# EAGLE design Tariq (EAGLE 9.0.1)
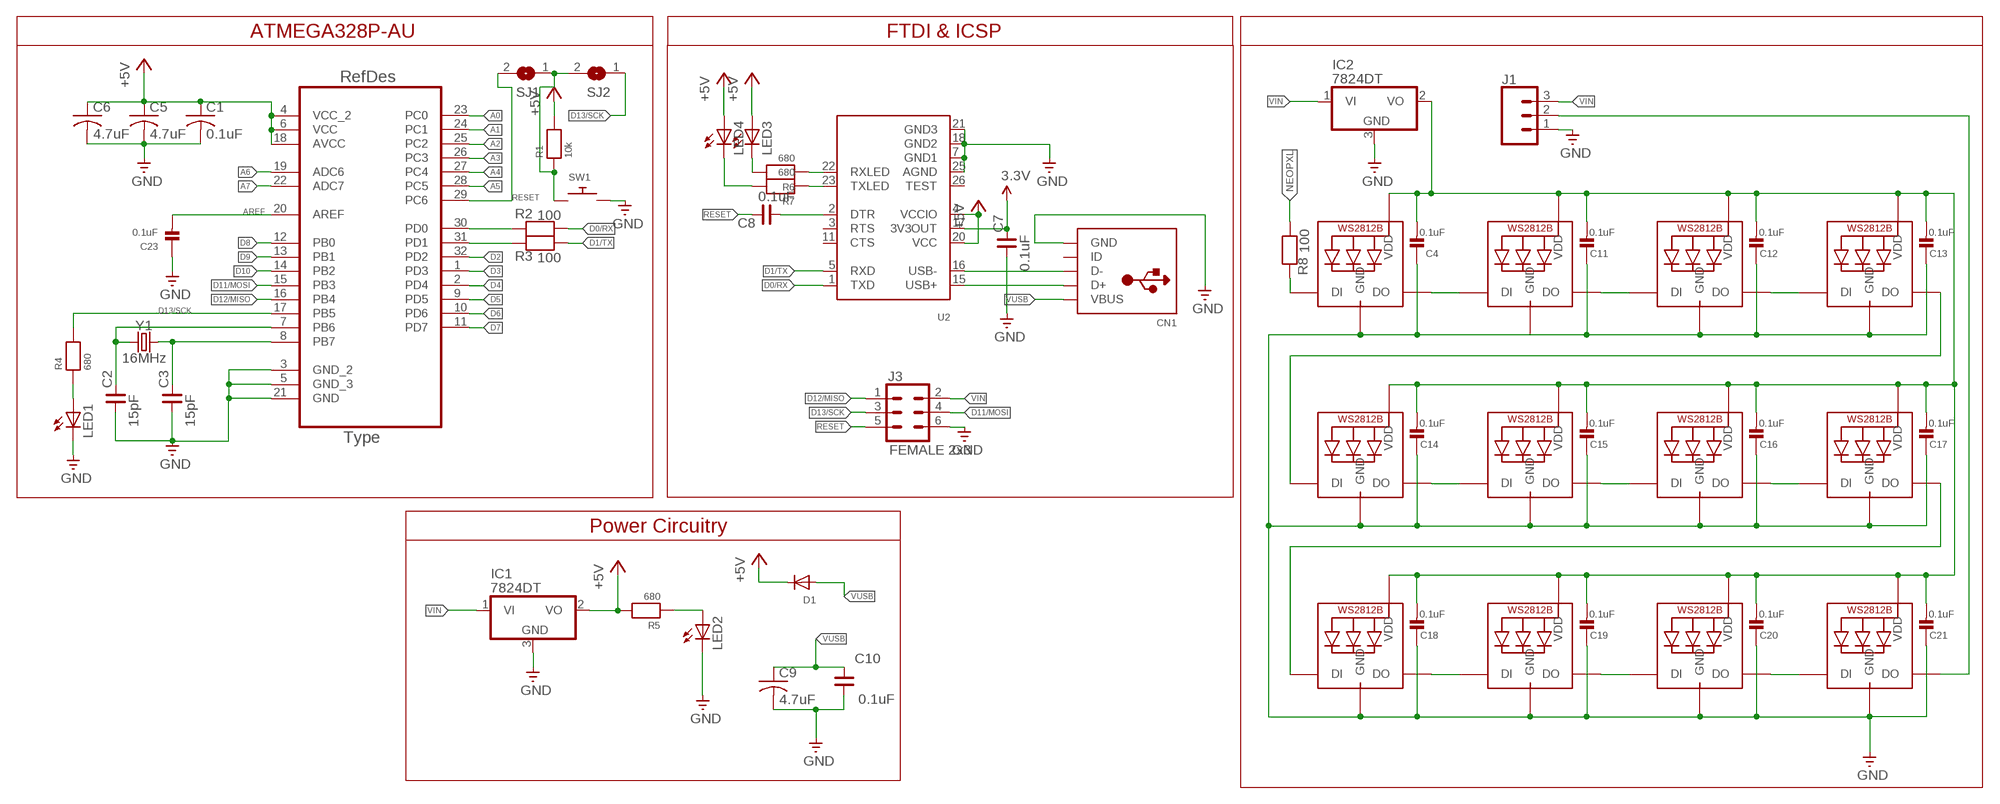
[diagram p0: schematic, sheet 1]

## Parts
C1  0.1uF  C-USC0805  [C0805]
C2  15pF  CNP-0805  [0805]
C3  15pF  CNP-0805  [0805]
C4  0.1uF  CAP_CERAMIC0603  [0603]
C5  4.7uF  C-USC0805  [C0805]
C6  4.7uF  C-USC0805  [C0805]
C7  0.1uF  CNP-0805  [0805]
C8  0.1uF  CNP-0805  [0805]
C9  4.7uF  C-USC0805  [C0805]
C10  0.1uF  CNP-0805  [0805]
C11  0.1uF  CAP_CERAMIC0603  [0603]
C12  0.1uF  CAP_CERAMIC0603  [0603]
C13  0.1uF  CAP_CERAMIC0603  [0603]
C14  0.1uF  CAP_CERAMIC0603  [0603]
C15  0.1uF  CAP_CERAMIC0603  [0603]
C16  0.1uF  CAP_CERAMIC0603  [0603]
C17  0.1uF  CAP_CERAMIC0603  [0603]
C18  0.1uF  CAP_CERAMIC0603  [0603]
C19  0.1uF  CAP_CERAMIC0603  [0603]
C20  0.1uF  CAP_CERAMIC0603  [0603]
C21  0.1uF  CAP_CERAMIC0603  [0603]
C23  0.1uF  CAP_CERAMIC0603  [0603]
CN1  USBMINIB  [USB-MINIB]
D1  DIODESOD-123  [SOD-123]
IC1  7824DT  [TO252]
IC2  7824DT  [TO252]
J1  CONN_03  [1X03]
J3  FEMALE 2x3  CONN_03X2FEMALE  [2X3]
LED1  LEDCHIPLED_0805  [CHIPLED_0805]
LED2  LEDCHIPLED_0805  [CHIPLED_0805]
LED3  LEDCHIPLED_0805  [CHIPLED_0805]
LED4  LEDCHIPLED_0805  [CHIPLED_0805]
LED5  WS2812B5050  [WS2812B]
LED6  WS2812B5050  [WS2812B]
LED7  WS2812B5050  [WS2812B]
LED8  WS2812B5050  [WS2812B]
LED9  WS2812B5050  [WS2812B]
LED10  WS2812B5050  [WS2812B]
LED11  WS2812B5050  [WS2812B]
LED12  WS2812B5050  [WS2812B]
LED13  WS2812B5050  [WS2812B]
LED14  WS2812B5050  [WS2812B]
LED15  WS2812B5050  [WS2812B]
LED16  WS2812B5050  [WS2812B]
R1  10k  RESISTOR0603  [0603]
R2  100  RESISTOR0603  [0603]
R3  100  RESISTOR0603  [0603]
R4  680  RESISTOR0603  [0603]
R5  680  RESISTOR0603  [0603]
R6  680  RESISTOR0603  [0603]
R7  680  RESISTOR0603  [0603]
R8  100  RESISTOR0603  [0603]
SJ1  SOLDERJUMPERWAVE  [SOLDERJUMPER_WAVE]
SJ2  SOLDERJUMPERWAVE  [SOLDERJUMPER_WAVE]
SW1  SWITCH_PUSHBUTTONEVQ-PE  [TACT_PANA-EVQ]
U1  ATMEGA328P-AU  [QFP80P900X900X120-32N]
U2  FT232RLSSOP28  [SSOP28DB]
Y1  16MHz  CRYSTAL-16MHZPTH-HC49US  [HC49US]

## Nets
3.3V: C7.2 U2.17(3V3OUT)
+5V: C1.1 C5.1 C6.1 D1.C IC1.2(VO) LED3.A LED4.A R1.2 R5.2 U1.4(VCC_2) U1.6(VCC) U1.18(AVCC) U2.4(VCCIO) U2.20(VCC)
A0: U1.23(PC0)
A1: U1.24(PC1)
A2: U1.25(PC2)
A3: U1.26(PC3)
A4: U1.27(PC4)
A5: U1.28(PC5)
A6: U1.19(ADC6)
A7: U1.22(ADC7)
AREF: C23.2 U1.20(AREF)
D0/RX: R2.1 U2.1(TXD)
D1/TX: R3.1 U2.5(RXD)
D2: U1.32(PD2)
D3: U1.1(PD3)
D4: U1.2(PD4)
D5: U1.9(PD5)
D6: U1.10(PD6)
D7: U1.11(PD7)
D8: U1.12(PB0)
D9: U1.13(PB1)
D10: U1.14(PB2)
D11/MOSI: J3.4 U1.15(PB3)
D12/MISO: J3.1 U1.16(PB4)
D13/SCK: J3.3 R4.2 SJ2.1 U1.17(PB5)
GND: C1.2 C2.1 C3.1 C4.1 C5.2 C6.2 C7.1 C9.2 C10.1 C11.1 C12.1 C13.1 C14.1 C15.1 C16.1 C17.1 C18.1 C19.1 C20.1 C21.1 C23.1 CN1.GND IC1.3(GND) IC2.3(GND) J1.1 J3.6 LED1.C LED2.C LED5.3-GND(GND) LED6.3-GND(GND) LED7.3-GND(GND) LED8.3-GND(GND) LED9.3-GND(GND) LED10.3-GND(GND) LED11.3-GND(GND) LED12.3-GND(GND) LED13.3-GND(GND) LED14.3-GND(GND) LED15.3-GND(GND) LED16.3-GND(GND) SW1.P$2 U1.3(GND_2) U1.5(GND_3) U1.21(GND) U2.7(GND1) U2.18(GND2) U2.21(GND3) U2.25(AGND)
N$1: C3.2 U1.8(PB7) Y1.2
N$2: C2.2 U1.7(PB6) Y1.1
N$4: LED2.A R5.1
N$5: CN1.D+ U2.15(USB+)
N$6: CN1.D- U2.16(USB-)
N$7: R2.2 U1.30(PD0)
N$8: R3.2 U1.31(PD1)
N$9: LED3.C R6.2
N$10: LED1.A R4.1
N$11: LED5.2-DOUT(DO) LED6.4-DIN(DI)
N$12: R6.1 U2.22(RXLED)
N$13: R7.1 U2.23(TXLED)
N$14: C8.1 U2.2(DTR)
N$15: LED4.C R7.2
N$16: LED6.2-DOUT(DO) LED7.4-DIN(DI)
N$17: LED7.2-DOUT(DO) LED8.4-DIN(DI)
N$18: LED8.2-DOUT(DO) LED9.4-DIN(DI)
N$19: C4.2 C11.2 C12.2 C13.2 C14.2 C15.2 C16.2 C17.2 C18.2 C19.2 C20.2 C21.2 IC2.2(VO) LED5.1-VDD(VDD) LED6.1-VDD(VDD) LED7.1-VDD(VDD) LED8.1-VDD(VDD) LED9.1-VDD(VDD) LED10.1-VDD(VDD) LED11.1-VDD(VDD) LED12.1-VDD(VDD) LED13.1-VDD(VDD) LED14.1-VDD(VDD) LED15.1-VDD(VDD) LED16.1-VDD(VDD)
N$20: LED9.2-DOUT(DO) LED10.4-DIN(DI)
N$21: LED10.2-DOUT(DO) LED11.4-DIN(DI)
N$22: LED11.2-DOUT(DO) LED12.4-DIN(DI)
N$23: LED12.2-DOUT(DO) LED13.4-DIN(DI)
N$24: LED13.2-DOUT(DO) LED14.4-DIN(DI)
N$25: LED14.2-DOUT(DO) LED15.4-DIN(DI)
N$26: LED15.2-DOUT(DO) LED16.4-DIN(DI)
N$27: LED5.4-DIN(DI) R8.2
N$29: J1.2 LED16.2-DOUT(DO)
N$30: R1.1 SJ1.1 SJ2.2 SW1.P$1
NEOPXL: R8.1
RESET: C8.2 J3.5 SJ1.2 U1.29(PC6)
VIN: IC1.1(VI) IC2.1(VI) J1.3 J3.2
VUSB: C9.1 C10.2 CN1.VBUS D1.A
Unconnected: CN1.ID U2.3(RTS) U2.11(CTS) U2.26(TEST)

## Notes on the sheet
- ATMEGA328P-AU | FTDI & ICSP
- Power Circuitry

## Library data of the parts
C1 C5 C6 C9 = adafruit:C-US: CAPACITOR, American symbol
C2 C3 C7 C8 C10 = cap-master:CNP-: NON-POLARIZED CAP
C4 C11-C21 C23 = microbuilder:CAP_CERAMIC: Ceramic Capacitors 0402 - 0402 Surface Mount Capacitors 16pF 50V 5% [Digikey: 445-4899-2-ND] 18pF 50V 5% [Digikey: 490-1281-2-ND] 22pF 50V 5% [Digikey: 490-1283-2-ND] 68pF 50V 5% [Digikey: 490-1289-2-ND] 0.1uF 10V 10% [Digikey: 490-1318-2-ND] 1.0uF 6.3V 10% [Digikey: 490-1320-2-ND] 0603 - 0603 Surface Mount Capacitors 16 pF 50V 5% [Digikey: 445-5051-2-ND] 22 pF 50V [Digikey: PCC220ACVTR-ND] 33 pF 50V 5% [Digikey: 490-1415-1-ND] 56pF 50V 5% [Digikey: 490-1421-1-ND] 220pF 50V 5% [Digikey: 445-1285-1-ND] 680 pF 50V 2200 pF 50V 5% C0G [Digikey: 445-1297-1-ND] 5600 pF 100V 5% X7R [Digikey: 478-3711-1-ND] 0.1 µF 25V 10% [Digikey: PCC2277TR-ND] 0.22 µF 16V 10% X7R [Digikey: 445-1318-1-ND] 1.0 µF 25V 10% [Digikey: 445-5146-2-ND] 0603 - RF Specific 3pF 250V +/-0.1pF RF [Digikey: 712-1347-1-ND] 18 pF 250V 5% [Digikey: 478-3505-1-ND or 712-1322-1-ND] 56 pF 250V 5% C0G RF [Digikey: 490-4867-1-ND] 68 pF 250V RF [Digikey: 490-4868-1-ND] 0805 - 0805 Surface Mount Capacitors 220 pF 250V 2% RF Ceramic Capacitor [Digikey: 712-1398-1-ND] 1000 pF 50V 2% NP0 Ceramic Capacitor [Digikey: 478-3760-1-ND] 0.1 µF 25V 10% Ceramic Capacitor [Digikey: PCC1828TR-ND] 1.0 µF 16V 10% Ceramic Capacitor[Digikey: 490-1691-2-ND] 10.0 µF 10V 10% Ceramic Capacitor[Digikey: 709-1228-1-ND] 10.0 uF 16V 10% Ceramic Capacitor [Digikey: 478-5165-2-ND] 47 uF 6.3V 20% Ceramic Capacitor [Digikey: 587-1779-1-ND or 399-5506-1-ND] 1206 - 1206 Surface Mount Capacitors 47uF 10V 20% Ceramic Capacitor [Digikey: 490-5528-1-ND or 399-5508-1-ND or 445-6010-1-ND]
CN1 = adafruit:USB: USB Connectors USBMINIB - Surface Mount Female Mini-B USB Connector 4UConnector: 06564 By microbuilder.eu Thru-hole RA Female Mini-B USB Connector 4UConnector: 18732 By ladyada.net
D1 = adafruit:DIODE: Diode SMADIODE - SMA Surface Mount Package 20V 1A Schottky Diode Digikey: 641-1014-6-ND DO-1N4148 - Through Hole Small Current Diode SOD-123 20V 1 A (.5mV Vf) Schottky Diode - Digikey: MBRX120TPMSCT-ND SOD-323 10V 570mA (.38mV Vf, 3ns) Schottky Diode - Digikey: ZLLS410CT-ND SOD-523 30V 30mA Schottky Diode (RB751S-40TE61) - Digikey: RB751S-40TE61CT-ND SOT23-R/W - SOT23 Package (R = Solder Paste/Reflow Ovens, W = Hand-Soldering) BAT54Film 40V 300mA - Digikey: 497-7162-1-ND
IC1 IC2 = adafruit:78*: Positive VOLTAGE REGULATOR Added bigger pads to the TO-92 package
J1 = SparkFun-Connectors:CONN_03: Multi connection point. Often used as Generic Header-pin footprint for 0.1 inch spaced/style header connections On any of the 0.1 inch spaced packages, you can populate with these: Break Away Headers - Straight <https://www.sparkfun.com/products/116> (PRT-00116) Break Away Male Headers - Right Angle <https://www.sparkfun.com/products/553> (PRT-00553) Female Headers <https://www.sparkfun.com/products/115> (PRT-00115) Break Away Headers - Machine Pin <https://www.sparkfun.com/products/117> (PRT-00117) Break Away Female Headers - Swiss Machine Pin <https://www.sparkfun.com/products/743> (PRT-00743) Stackable Header - 3 Pin (Female, 0.1") <https://www.sparkfun.com/products/13875> (PRT-13875) For SCREWTERMINALS and SPRING TERMINALS visit here: Screw Terimnals on SparkFun.com <https://www.sparkfun.com/search/results?term=Screw+Terminals> (5mm/3.5mm/2.54mm spacing) This device is also useful as a general connection point to wire up your design to another part of your project. Our various solder wires solder well into these plated through hole pads. Hook-Up Wire - Assortment (Stranded, 22 AWG) <https://www.sparkfun.com/products/11375> (PRT-11375) Hook-Up Wire - Assortment (Solid Core, 22 AWG) <https://www.sparkfun.com/products/11367> (PRT-11367) View the entire wire category on our website here <https://www.sparkfun.com/categories/141> Special notes: Molex polarized connector foot print use with SKU : PRT-08232 with associated crimp pins and housings.
J3 = SparkFun-Connectors:CONN_03X2: Multi connection point. Often used as Generic Header-pin footprint for 0.1 inch spaced/style header connections You can populate with any combo of single row headers, but if you'd like an exact match, check these: Header - 2x3 (Male, 0.1") <https://www.sparkfun.com/products/12807> (PRT-12807) Header - 2x3 (Female, 0.1") <https://www.sparkfun.com/products/13010> (PRT-13010) 2x3 Pin Shrouded Header <https://www.sparkfun.com/products/10877> (PRT-10877) On any of the 0.1 inch spaced packages, you can populate with these: Break Away Headers - Straight <https://www.sparkfun.com/products/116> (PRT-00116) Break Away Male Headers - Right Angle <https://www.sparkfun.com/products/553> (PRT-00553) Female Headers <https://www.sparkfun.com/products/115> (PRT-00115) Break Away Headers - Machine Pin <https://www.sparkfun.com/products/117> (PRT-00117) Break Away Female Headers - Swiss Machine Pin <https://www.sparkfun.com/products/743> (PRT-00743) Special note: the shrouded connector mates well with our 3x2 ribbon cables: Ribbon Crimp Connector - 6-pin (2x3, Female) <https://www.sparkfun.com/products/10651> (PRT-10651) Ribbon Cable - 6 wire (15ft) <https://www.sparkfun.com/products/10646> (PRT-10646); PROD_ID: CONN-11566
LED1-LED4 = adafruit:LED: LED OSRAM: - CHIPLED LG R971, LG N971, LY N971, LG Q971, LY Q971, LO R971, LY R971 LH N974, LH R974 LS Q976, LO Q976, LY Q976 LO Q996 - Hyper CHIPLED LW Q18S LB Q993, LB Q99A, LB R99A - SideLED LS A670, LO A670, LY A670, LG A670, LP A670 LB A673, LV A673, LT A673, LW A673 LH A674 LY A675 LS A676, LA A676, LO A676, LY A676, LW A676 LS A679, LY A679, LG A679 - Hyper Micro SIDELED® LS Y876, LA Y876, LO Y876, LY Y876 LT Y87S - SmartLED LW L88C, LW L88S LB L89C, LB L89S, LG L890 LS L89K, LO L89K, LY L89K LS L896, LA L896, LO L896, LY L896 - TOPLED LS T670, LO T670, LY T670, LG T670, LP T670 LSG T670, LSP T670, LSY T670, LOP T670, LYG T670 LG T671, LOG T671, LSG T671 LB T673, LV T673, LT T673, LW T673 LH T674 LS T676, LA T676, LO T676, LY T676, LB T676, LH T676, LSB T676, LW T676 LB T67C, LV T67C, LT T67C, LS T67K, LO T67K, LY T67K, LW E67C LS E67B, LA E67B, LO E67B, LY E67B, LB E67C, LV E67C, LT E67C LW T67C LS T679, LY T679, LG T679 LS T770, LO T770, LY T770, LG T770, LP T770 LB T773, LV T773, LT T773, LW T773 LH T774 LS E675, LA E675, LY E675, LS T675 LS T776, LA T776, LO T776, LY T776, LB T776 LHGB T686 LT T68C, LB T68C - Hyper Mini TOPLED® LB M676 - Mini TOPLED Santana® LG M470 LS M47K, LO M47K, LY M47K Source: http://www.osram.convergy.de/
LED5-LED16 = adafruit:WS2812B
R1-R8 = microbuilder:RESISTOR: Resistors 0402 - 0402 Surface Mount Package 22 Ohm 1% 1/16W [Digikey: 311-22.0LRTR-ND] 33 Ohm 5% 1/16W 1.0K 5% 1/16W 1.5K 5% 1/16W 2.0K 1% 1/16W 10.0K 1% 1/16W [Digikey: 311-10.0KLRTR-ND] 10.0K 5% 1/16W [Digikey: RMCF0402JT10K0TR-ND] 12.1K 1% 1/16W [Digikey: 311-22.0LRTR-ND] 100.0K 5% 1/16W 0603 - 0603 Surface Mount Package 0 Ohm 1/10 Watt 1% Resistor 15 Ohm 1/10 Watt 1% Resistor 33 Ohm 1/10 Watt 1% Resistor 49.9 Ohm 1/10 Watt 1% Resistor 100 Ohm 1/10 Watt 1% Resistor 150 Ohm 1/10 Watt 1% Resistor 240 Ohm 1/10 Watt 1% Resistor 390 Ohm 1/10 Watt 1% Resistor 560 Ohm 1/10 Watt 1% Resistor 680 Ohm 1/10 Watt 1% Resistor 750 Ohm 1/10 Watt 1% Resistor 1.0K Ohm 1/10 Watt 1% Resistor 1.5K Ohm 1/10 Watt 1% Resistor 2.0K Ohm 1/10 Watt 1% Resistor 2.2K Ohm 1/10 Watt 1% Resistor 3.3K Ohm 1/10 Watt 1% Resistor 4.7K Ohm 1/10 Watt 1% Resistor 10.0K Ohm 1/10 Watt 1% Resistor 12.0K Ohm 1/10 Watt 1% Resistor 12.1K Ohm 1/10 Watt 1% Resistor 20.0K Ohm 1/10 Watt 1% Resistor 33.0K Ohm 1/10 Watt 1% Resistor 100.0K Ohm 1/10 Watt 1% Resistor 0805 - 0805 Surface Mount Package 0 Ohm 1/8 Watt 1% Resistor 33 Ohm 1/8 Watt 1% Resistor 100 Ohm 1/8 Watt 1% Resistor 150 Ohm 1/8 Watt 1% Resistor 200 Ohm 1/8 Watt 1% Resistor 240 Ohm 1/8 Watt 1% Resistor 330 Ohm 1/8 Watt 1% Resistor 390 Ohm 1/8 Watt 1% Resistor 470 Ohm 1/8 Watt 1% Resistor 1.0K Ohm 1/8 Watt 1% Resistor 1.5K Ohm 1/8 Watt 1% Resistor 2.0K Ohm 1/8 Watt 1% Resistor 4.7K Ohm 1/8 Watt 1% Resistor 5.1K Ohm 1/8 Watt 1% Resistor 5.6K Ohm 1/8 Watt 1% Resistor 10.0K Ohm 1/8 Watt 1% Resistor 22.0K Ohm 1/8 Watt 1% Resistor 33.0K Ohm 1/8 Watt 1% Resistor 100K Ohm 1/8 Watt 1% Resistor 1206 - 1206 Surface Mount Package 2012 - 2010 Surface Mount Package 0.11 Ohm 1/2 Watt 1% Resistor - Digikey: RHM.11UCT-ND
SJ1 SJ2 = microbuilder:SOLDERJUMPER: SMD Solder JUMPER Solder the two pads together to create a connection, or remove the solder to break it. REFLOW - Use this footprint for solder paste and reflow ovens. WAVE - Use this footprint for hand-soldering (larger pads). CLOSED - Has a trace between the two pads to ensure it is closed by default. The trace needs to be cut to disable the jumper, and can be closed again by creating a solder bridge between the two pads.
SW1 = adafruit:SWITCH_PUSHBUTTON: Buttons SOFTTOUCHSMD_SJ - Soft touch temporary push button (Super Junk Akihabara) Compatible with SKPMANE010 [Mouser: 688-SKPMAN] C&K_KSS = Digikey: KSS221GLFS
U1 = Atmel-ATMEGA328P-AU:ATMEGA328P-AU; DESCRIPTION: 8-bit Microcontroller with In-System Programmable Flash; MPN: ATMEGA328P-AU; OC_FARNELL: 1715486; OC_NEWARK: 14R4631; PACKAGE: TQFP-32; SUPPLIER: Atmel
U2 = microbuilder:FT232RL: FTDI FT232RL USB TO RS232 Converter Digikey: 768-1007-1-ND
Y1 = SparkFun-Clocks:CRYSTAL-16MHZ: 16MHz Crystal Digikey Example <http://www.digikey.com/product-search/en?keywords=535-9122-1-ND> Frequency: 16MHz Frequency Stability: ±50ppm Frequency Tolerance: ±20ppm Load Capacitance: 18pF SparkFun Products: Pro Micro -5V/16MHz <https://www.sparkfun.com/products/12640> SparkFun Serial Enabled LCD Kit <https://www.sparkfun.com/products/10097>; PROD_ID: XTAL-08181; SF_ID: COM-00536

## Board
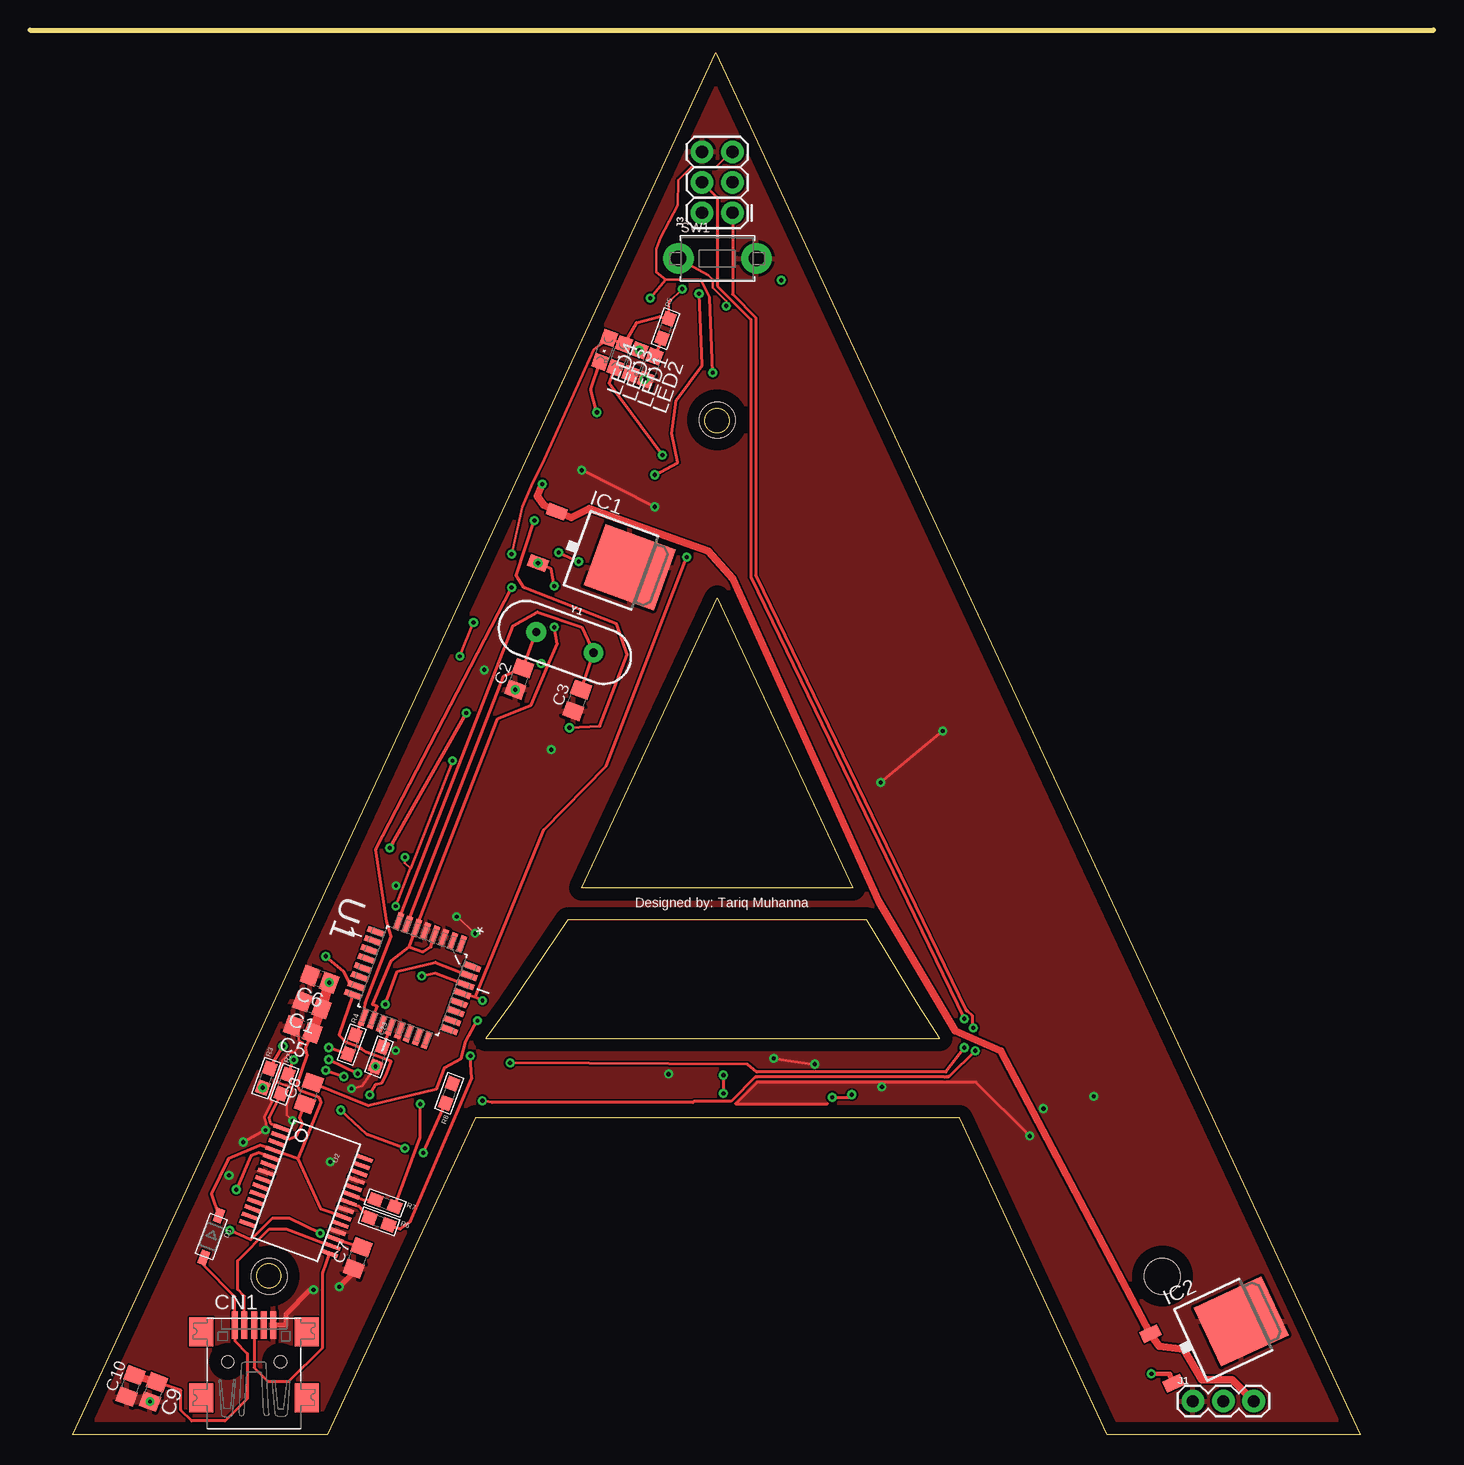
[diagram p1: board, top side]
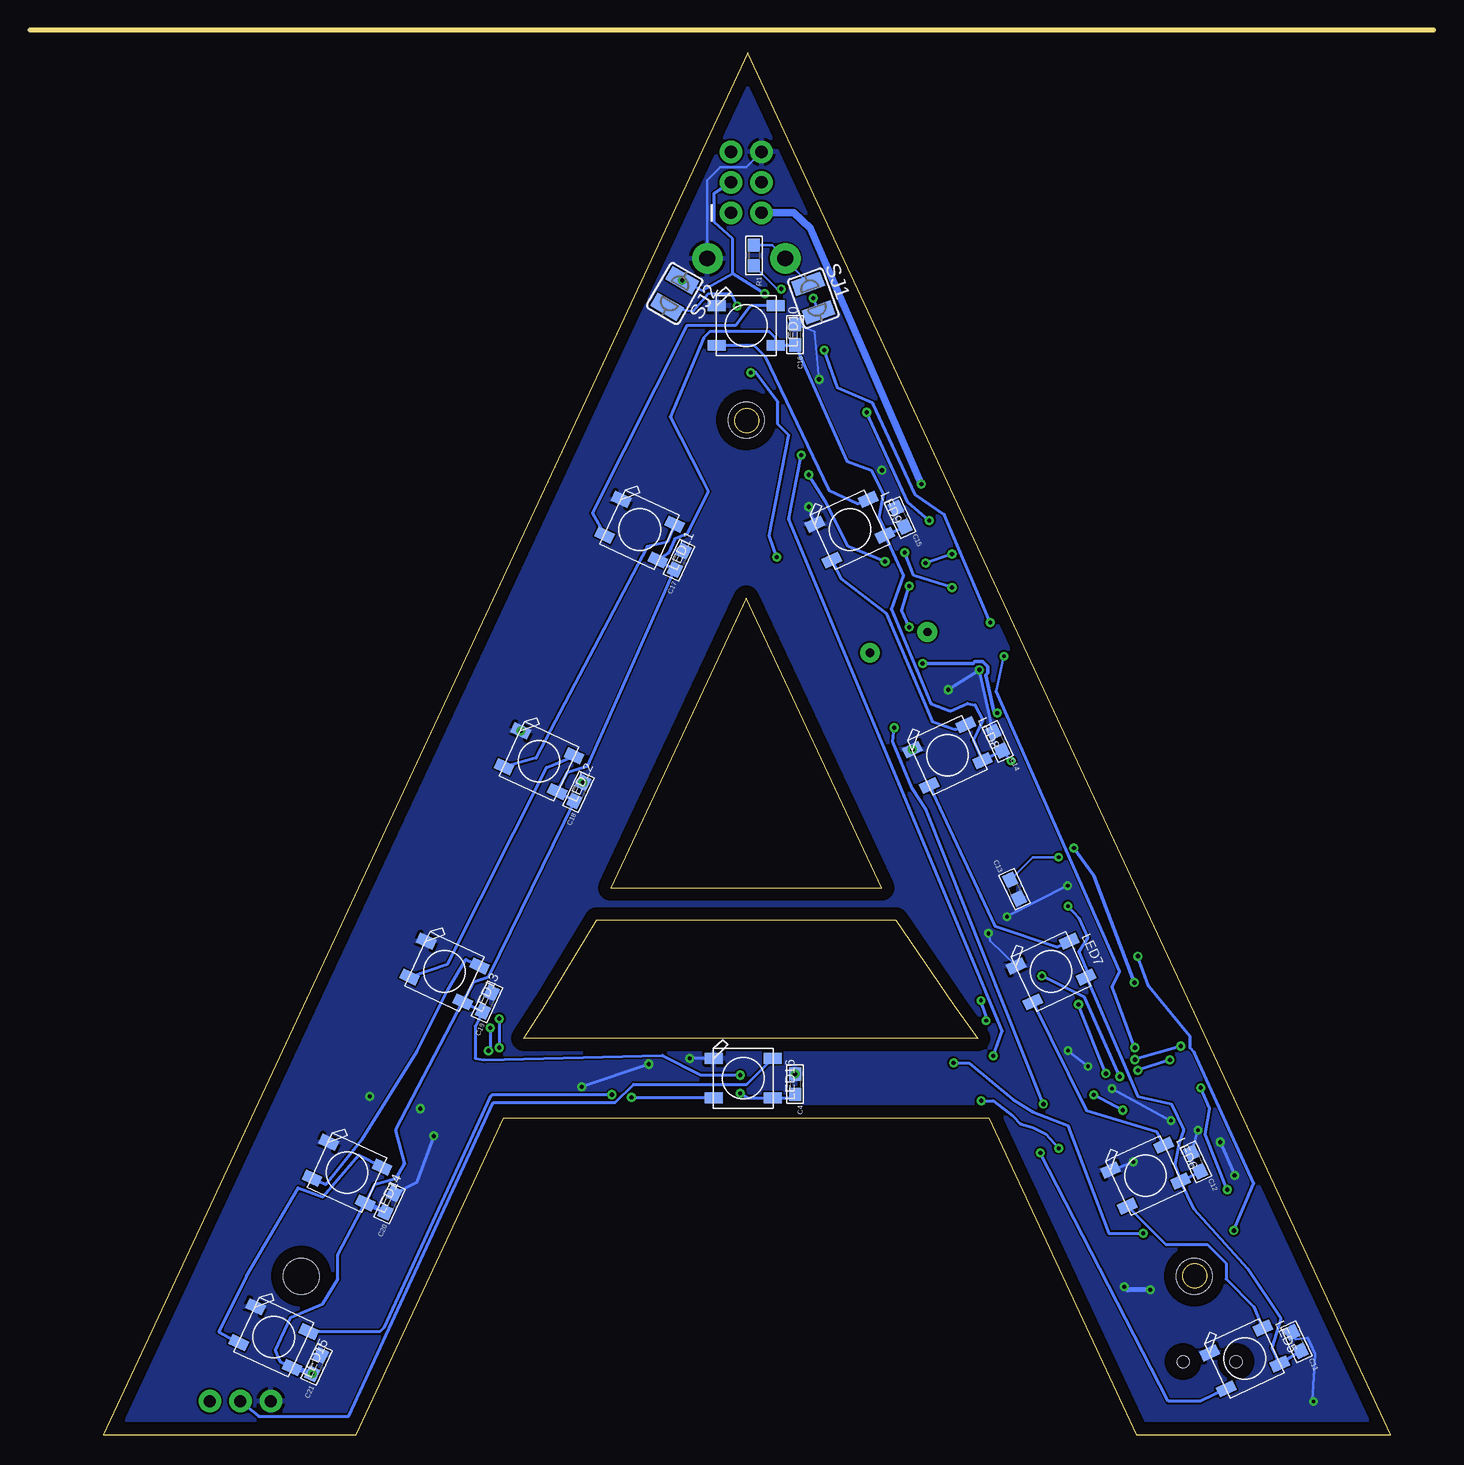
[diagram p2: board, bottom side, seen from below]

Size 116.97 x 117.09 mm. Coordinates in mm from the lower left corner, seen from the top.
Outline: 0,117.09 116.97,117.09
Outline: 37.97,33.02 75.82,33.02 74.04,35.81 69.72,42.93 44.83,42.93 40.01,35.81 37.97,33.02
Outline: 45.97,45.59 57.28,69.72 68.58,45.59 45.97,45.59
Outline: 3.56,0 57.15,115.19 110.87,0 89.79,0 77.47,26.42 37.08,26.42 24.77,0 3.56,0
Outline: circle at 19.9,13.22 radius 1.01
Outline: circle at 19.9,13.22 radius 1.01
Outline: circle at 57.25,84.53 radius 1.01
Outline: circle at 57.25,84.53 radius 1.01
Copper layers (1*16): Top 0.035mm / dielectric 1.5mm / Bottom 0.035mm
Design rules "default": minimum track width 6mil, minimum drill 0.35mm, track to track 6mil, track to pad 6mil, pad to pad 6mil, via to via 6mil, smd to smd 6mil, copper to edge 40mil, drill to drill 6mil, minimum pad ring 10mil, minimum via ring 8mil, stop-mask expansion 4mil, vias tented up to drill 0mil, thermal gap 10mil
Holes 3 mm at 19.94,13.21 94.36,13.21 57.28,84.58

### Footprints (pad centres in the part's own frame; a part is rotated, then mirrored left to right if it is on the bottom)
C0805 = smd 1.3 x 1.5: 1 -0.85,0; 2 0.85,0
0805 = smd 1.27 x 1.524: 1 -0.953,0; 2 0.953,0
0603 = smd 1.1 x 1: 1 -0.85,0; 2 0.85,0
USB-MINIB = smd 0.5 x 2.308: D+ 0,4.064; D- -0.8,4.064; GND 1.6,4.064; ID 0.8,4.064; VBUS -1.6,4.064 | smd 2 x 2.4: GND1 -4.4,-2; GND2 -4.4,3.5; GND3 4.4,3.5; GND4 4.4,-2 | hole 1: -2.2,1; 2.2,1
SOD-123 = smd 1.2 x 0.7: A 1.85,0; C -1.85,0
TO252 = smd 1 x 1.6: 1 -2.28,-4.8; 2 2.28,-4.8 | smd 5.4 x 6.2: 3 0,2.5
1X03 = drill 1.016 pad 1.88: 1 0,0; 2 2.54,0; 3 5.08,0
2X3 = drill 1.016 pad 1.88: 1 0,0; 2 0,2.54; 3 2.54,0; 4 2.54,2.54; 5 5.08,0; 6 5.08,2.54
CHIPLED_0805 = smd 1.2 x 1.2: A 0,-1.05; C 0,1.05
WS2812B = smd 1.5 x 0.9: 1-VDD 2.45,-1.65; 2-DOUT 2.45,1.65; 3-GND -2.45,1.65; 4-DIN -2.45,-1.65
SOLDERJUMPER_WAVE = smd 1.27 x 2.54: 1 -1.27,0; 2 1.27,0
TACT_PANA-EVQ = drill 1.3 pad 2.54: P$1 -3.25,0; P$2 3.25,0
QFP80P900X900X120-32N = smd 1.473 x 0.508: 1 -4.242,2.794; 2 -4.242,2.007; 3 -4.242,1.194; 4 -4.242,0.406; 5 -4.242,-0.406; 6 -4.242,-1.194; 7 -4.242,-2.007; 8 -4.242,-2.794; 17 4.242,-2.794; 18 4.242,-2.007; 19 4.242,-1.194; 20 4.242,-0.406; 21 4.242,0.406; 22 4.242,1.194; 23 4.242,2.007; 24 4.242,2.794 | smd 0.508 x 1.473: 9 -2.794,-4.242; 10 -2.007,-4.242; 11 -1.194,-4.242; 12 -0.406,-4.242; 13 0.406,-4.242; 14 1.194,-4.242; 15 2.007,-4.242; 16 2.794,-4.242; 25 2.794,4.242; 26 2.007,4.242; 27 1.194,4.242; 28 0.406,4.242; 29 -0.406,4.242; 30 -1.194,4.242; 31 -2.007,4.242; 32 -2.794,4.242
SSOP28DB = smd 0.348 x 1.397: 1 -4.225,-3.656; 2 -3.575,-3.656; 3 -2.925,-3.656; 4 -2.275,-3.656; 5 -1.625,-3.656; 6 -0.975,-3.656; 7 -0.325,-3.656; 8 0.325,-3.656; 9 0.975,-3.656; 10 1.625,-3.656; 11 2.275,-3.656; 12 2.925,-3.656; 13 3.575,-3.656; 14 4.225,-3.656; 15 4.225,3.656; 16 3.575,3.656; 17 2.925,3.656; 18 2.275,3.656; 19 1.625,3.656; 20 0.975,3.656; 21 0.325,3.656; 22 -0.325,3.656; 23 -0.975,3.656; 24 -1.625,3.656; 25 -2.275,3.656; 26 -2.925,3.656; 27 -3.575,3.656; 28 -4.225,3.656
HC49US = drill 0.7 pad 1.651: 1 -2.54,0; 2 2.54,0

### Placement (x,y rotation side)
C1  23.5,35.81 160 top
C2  40.77,62.99 70 top
C3  45.59,61.21 70 top
C4  53.21,29.21 270 bottom
C5  22.73,33.78 160 top
C6  24.13,37.97 160 top
C7  27.3,14.73 70 top
C8  23.24,28.45 70 top
C9  10.29,3.56 250 top
C10  8.38,4.06 70 top
C11  11.43,7.75 295 bottom
C12  19.81,22.73 295 bottom
C13  34.92,45.47 115 bottom
C14  36.32,57.78 295 bottom
C15  44.45,76.45 295 bottom
C16  53.21,91.69 270 bottom
C17  62.87,72.9 245 bottom
C18  71.25,53.59 245 bottom
C19  78.87,36.07 245 bottom
C20  87,19.3 245 bottom
C21  93.09,5.84 245 bottom
C23  29.08,31.5 70 top
CN1  18.67,5.08 0 top
D1  15.11,16.51 250 top
IC1  47.62,73.15 250 top
IC2  98.68,8.38 295 top
J1  96.9,2.79 0 top
J3  58.55,101.85 90 top
LED1  50.42,89.41 160 top
LED2  51.69,88.9 160 top
LED3  49.15,89.92 160 top
LED4  47.88,90.42 160 top
LED5  15.75,6.35 25 bottom
LED6  24,21.59 25 bottom
LED7  31.88,38.61 25 bottom
LED8  40.51,56.64 25 bottom
LED9  48.64,75.44 25 bottom
LED10  57.28,92.46 0 bottom
LED11  66.17,75.44 335 bottom
LED12  74.55,56.13 335 bottom
LED13  82.42,38.61 335 bottom
LED14  90.55,21.84 335 bottom
LED15  96.65,8.13 335 bottom
LED16  57.53,29.72 0 bottom
R1  56.64,98.3 270 bottom
R2  21.21,29.21 70 top
R3  19.68,29.72 70 top
R4  26.8,32.51 70 top
R5  52.96,92.2 70 top
R6  29.08,17.78 340 top
R7  29.59,19.3 340 top
R8  34.92,28.45 250 top
SJ1  51.69,94.74 290 bottom
SJ2  63.25,95.12 240 bottom
SW1  57.28,98.04 0 top
U1  31.88,37.85 250 top
U2  22.99,20.32 250 top
Y1  44.58,66.04 340 top

### Tracks (layer width: path | path; a pad name or v marks a point on that pad's centre or on a via)
3.3V
  Top 0.254: U2.17 C7.2
+5V  (via drill 0.35)
  Top 0.203: LED4.A 47,90.46 46.23,88.77 42.67,80.9 41.91,79.38 41.02,77.34 v40.13,73.41 | v54.36,95.5 53.25,94.4 R5.2
  Top 0.254: U2.20 24.26,18.8 22.35,22.99 | 22.35,22.99 U2.4 19.56,24 19.18,24.13 16.51,22.99 15.11,20.07 D1.C | 22.35,22.99 24.26,27.69 24.13,28.07 24.1,28.07 24.05,28.11 22.51,28.67 22.51,28.7 22.42,28.8 22.42,28.81 22.23,29.08 23.11,31.62 22.99,32.26 C5.1 | U1.18 28.96,35.69 28.8,35.75 28.54,35.86 30.1,39.5 31.62,40.64 | LED4.A LED3.A 50.55,92.71 52.45,93.22 R5.2 | 31.62,40.64 U1.6 38.99,59.69 41.78,60.83 43.17,64.09 43.94,65.91 v43.69,67.31 | 31.62,40.64 32.77,40.26 33.4,40.64 U1.4 | v43.69,70.74 43.43,72.14 IC1.2
  Top 0.305: v29.97,48.9 v36.37,60.15 | v42.59,64.28 43.17,64.09
  Top 0.813: C5.1 C1.1 C6.1
  Bottom 0.203: R1.2 54.7,95.5 v54.36,95.5
  Bottom 0.254: v43.69,67.31 44.32,68.71 v43.69,70.74 | v40.13,73.41 IC1.2
  Bottom 0.305: C6.1 28.32,46.61 v29.97,48.9 | v36.37,60.15 36.64,60.33 37.31,63.33 37.16,63.47 37.16,64.04 37.56,64.44 38.22,64.44 38.38,64.28 v42.59,64.28
  other vias: 42.33,72.65 24.93,37.68
AREF
  Top 0.254: U1.20 C23.2
D0/RX
  Top 0.254: U2.1 20.07,25.91 19.94,26.42 R2.1
D1/TX  (via drill 0.35)
  Top 0.254: U2.5 19.05,23.5 18.41,23.24 v17.2,20.43
  Bottom 0.254: v17.2,20.43 19.05,25.02 18.67,27.18 R3.1
  other vias: 19.39,28.92
D11/MOSI  (via drill 0.35)
  Top 0.254: J3.4 57.28,103.12 57.28,95.76 60.07,92.96 60.07,71.5 v77.85,34.67 | v77.85,32.26 76.33,30.23 60.58,30.23 59.82,30.86 v40.01,30.99 | v24.18,16.79 21.59,18.03 20.19,18.03 18.41,16.26 v16.64,17.02 | U1.15 26.67,37.59 26.16,38.61 v24.64,39.88
  Bottom 0.254: v77.85,34.67 v77.85,32.26 | v40.01,30.99 38.73,30.99 35.05,27.94 33.4,26.92 30.48,25.78 27.05,16.76 v24.18,16.79 | v16.64,17.02 14.99,20.95 19.94,31.88 20.3,32.23 20.3,33.16 23.75,37.38 v24.64,39.88
D12/MISO  (via drill 0.35)
  Top 0.254: J3.1 58.55,95.06 60.48,93.13 60.48,71.63 78,35.33 78.12,35.33 78.51,34.94 78.51,34.02 v78.62,33.91 | v78.76,32 76.6,29.84 76.53,29.84 76.52,29.84 76.5,29.82 76.36,29.82 76.22,29.8 76.19,29.82 60.6,29.82 60.45,29.81 58.43,27.79 55.35,27.79 55.24,27.69 38.49,27.69 v37.7,27.84 | v31.24,23.88 28.07,25.02 v25.91,27.05 | v28.32,28.32 28.83,29.21 29.34,29.34 29.72,30.1 30.1,31.11 28.07,31.88 27.69,32.13 27.35,32.33 26.23,32.74 26.15,32.91 25.78,33.27 U1.16
  Bottom 0.254: v78.62,33.91 78.62,32.15 v78.76,32 | v37.7,27.84 36.71,27.84 35.04,26.55 34.44,25.91 33.4,25.59 32.31,25.07 v31.24,23.88 | v25.91,27.05 v28.32,28.32
D13/SCK  (via drill 0.35)
  Top 0.254: R4.2 U1.17 27.94,35.94 30.1,41.53 29.72,42.8 28.83,48.77 v40.13,70.61 | v44.07,73.53 v45.72,72.77 | v52.07,80.01 53.98,81.03 53.47,83.44 53.85,86.23 56.01,89.15 v55.75,95.12
  Bottom 0.203: 58.42,96.77 60.96,95.38 SJ2.1
  Bottom 0.254: v40.13,70.61 43.31,71.63 v44.07,73.53 | v45.72,72.77 48.77,74.04 50.67,77.72 v52.07,80.01 | v55.75,95.12 58.42,96.77 58.42,99.69 59.94,101.09 59.94,103.5 J3.3
  other vias: 62.61,96.22
GND  (via drill 0.3, 0.35)
  Top 0.203: v37.08,41.78 v35.56,43.18 | v19.63,25.4 19.7,25.47 19.7,25.79 19.65,25.9 19.67,25.93 19.57,26.31 19.53,26.44 19.54,26.46 19.53,26.48 19.6,26.6 20.2,27.82 20.07,27.86 19.99,28.05 20.43,29.29 20.57,29.42 | 20.57,29.42 20.57,29.65 21.02,30.88 21.02,31.18 21.71,31.87 21.97,31.87 22.73,32.64 22.66,32.71 22.57,32.71 22.39,32.9 22.39,33.62 C5.2 | C23.1 27.69,29.08 v26.8,28.83 | v21.89,26.18 21.4,26.66 21.4,27.54 21.85,28.77 21.76,28.96 20.62,29.37 20.61,29.37 20.57,29.42
  Top 0.254: LED2.C v51.21,87.97 | v52.07,77.34 v45.97,80.39 | C18.1 LED12.3-GND | v83.31,24.89 78.83,29.37 60.59,29.37 58.8,27.59 66.44,27.59 | v61.98,31.37 v65.41,30.88 | v19.63,25.4 v17.78,24.38
  Top 0.406: CN1.GND 21.34,9.14 21.34,10.03 23.37,12.06 v23.62,12.06 | v25.78,12.32 26.98,13.52 C7.1
  Bottom 0.152: v51.21,87.97 51.56,91.95 C16.1
  Bottom 0.203: LED7.3-GND 36.96,41.15 v37.08,41.78 | v35.56,43.18 v30.49,45.77 | C11.1 11.49,7.96 10.48,8.09 9.86,6.7 10.11,2.87 C9.2 | C12.1 v19.63,25.4 | v26.8,28.83 v21.89,26.18 | C23.1 v30.48,32 | J3.6 57.28,105.66 59.44,105.66 60.53,104.57 SW1.P$2
  Bottom 0.254: C14.1 v37.85,63.75 C2.1 | LED9.3-GND v52.07,77.34 | C20.1 84.71,21.08 83.31,24.77 v83.31,24.89 | LED16.3-GND v61.98,31.37 | v65.41,30.88 v70.99,29 | v17.78,24.38 v16.59,21.62 | LED6.3-GND v25.02,22.73
  Bottom 0.406: v23.62,12.06 25.53,12.06 v25.78,12.32
  other vias: 43.43,57.1 40.44,62.1 70.89,54.36 76.07,58.66 84.46,27.18 88.65,28.19 10,2.76 28.79,30.7 53.21,30.06
  pour Top: 1.4,-0.51 1.4,117.6 100.46,117.6 113.41,117.6 113.41,2.54 113.41,-0.51
  pour Bottom: -1.91,-1.27 -1.91,117.6 115.19,117.6 115.19,-1.27
N$1
  Top 0.254: C3.2 Y1.2 45.97,67.31 42.29,68.58 40.26,67.44 U1.8
N$2
  Top 0.254: C2.2 41.11,63.94 | 41.11,63.94 Y1.1 | U1.7 39.5,63.25 41.11,63.94
N$4
  Top 0.254: R5.1 LED2.A
N$5
  Top 0.254: CN1.D+ 18.67,5.59 19.82,4.44 21.58,4.44 24.38,7.24 24.38,13.46 U2.15
N$6
  Top 0.254: CN1.D- 17.87,11.54 17.3,12.11 17.3,14.5 19.94,17.14 21.34,17.14 U2.16
N$7  (via drill 0.35)
  Top 0.254: R2.2 v21.97,31.24 | v24.64,30.35 v26.16,29.84 | v32.64,38.23 33.78,38.48 U1.30
  Bottom 0.254: v21.97,31.24 v24.64,30.35 | v26.16,29.84 29.08,36.45 v32.64,38.23
N$8  (via drill 0.35)
  Top 0.254: R3.2 v21.08,32.38 | v24.89,31.26 v27.3,30.1 | v29.59,35.88 30.61,38.61 33.78,39.37 U1.31
  Bottom 0.254: v21.08,32.38 v24.89,31.26 | v27.3,30.1 v29.59,35.88
N$9  (via drill 0.35)
  Top 0.254: R6.2 30.86,17.14 31.7,17.75 36.83,29.72 v36.7,31.58 | v52.7,81.66 48.26,87.63 LED3.C
  Bottom 0.254: v36.7,31.58 35.94,33.66 53.72,76.33 v52.7,81.66
N$10  (via drill 0.3, 0.35)
  Top 0.203: v35.81,64.9 v36.96,67.69
  Top 0.254: R4.1 v24.89,32.26
  Bottom 0.203: 36.45,61.98 v35.81,64.9
  Bottom 0.254: v24.89,32.26 26.8,37.34 26.16,38.61 36.45,61.98 | v36.96,67.69 40.77,76.71 43.18,78.36 46.74,85.98 49.66,87.25 LED1.A
  other vias: 50.78,90.39
N$11
  Bottom 0.254: LED6.4-DIN 22.32,15.85 18.84,15.85 17.3,14.3 17.3,12.98 14.99,10.67 LED5.2-DOUT
N$12
  Top 0.254: U2.22 27.43,19.05 R6.1
N$13
  Top 0.254: U2.23 27.81,19.56 R7.1
N$14
  Top 0.254: U2.2 21.59,24.64 22.23,24.89 22.73,25.91 22.48,26.42 C8.1
N$15  (via drill 0.35)
  Top 0.254: R7.2 32.51,24.77 v32.51,27.56 | v44.96,58.93 47.5,59.05 49.78,65.02 48.9,67.56 41.15,70.61 40.51,71.63 v42.04,76.2 | v47.24,85.22 46.74,87.12 LED4.C
  Bottom 0.254: v32.51,27.56 42.29,52.07 43.43,53.85 45.09,57.78 v44.96,58.93 | v42.04,76.2 43.81,77.72 v47.24,85.22
N$16
  Bottom 0.254: LED7.4-DIN 28.96,27.05 23.11,25.27 LED6.2-DOUT
N$17
  Bottom 0.254: LED8.4-DIN 36.58,42.42 31.37,40.64 LED7.2-DOUT
N$18
  Bottom 0.254: LED9.4-DIN 49.4,71.37 45.59,68.45 41.78,59.44 39.88,58.8 LED8.2-DOUT
N$19  (via drill 0.3, 0.35)
  Top 0.203: v30.48,44.07 31.62,46.99 31.66,47.1 31.71,47.21 | 31.71,47.21 v35.21,56.17 | 31.71,47.21 31.24,47.68 v31.24,48.13
  Top 0.254: v57.78,29.97 v57.78,28.45
  Top 0.406: IC2.2 95,5.05 C21.2
  Bottom 0.203: v35.21,56.17 C14.2 | v31.24,48.13 33.39,48.13 C13.2
  Bottom 0.254: LED13.1-VDD 86.49,25.4 85.72,22.61 86.49,21.34 88.26,20.83 LED14.1-VDD 91.31,14.99 91.31,12.95 92.58,10.92 95.25,9.78 96.52,6.99 96.14,6.1 LED15.1-VDD | LED13.1-VDD C19.2 79.88,34.04 79.88,31.37 79.12,31.24 64.26,31.62 61.09,29.97 v57.78,29.97 | v57.78,28.45 57.15,28.07 LED16.1-VDD 53.51,28.07 C4.2 | LED13.1-VDD 80.01,37.72 78.91,38.08 78.81,38.12 78.78,38.2 78.74,38.23 C18.2 LED12.1-VDD 72.14,55.24 70.49,55.75 C17.2 LED11.1-VDD 63.75,73.53 63.25,74.68 62.23,75.06 60.45,78.61 60.96,79.63 63.63,84.84 60.83,91.44 60.33,91.95 55.37,91.95 54.83,91.4 LED10.1-VDD C16.2 48.9,81.15 46.86,80.39 45.85,78.36 46.23,76.45 45.59,75.04 | 45.59,75.04 LED9.1-VDD 44.2,71.63 45.21,68.83 41.91,60.96 40.26,60.33 38.86,60.96 38.23,60.83 37.59,59.56 37.97,58.67 38.35,57.91 LED8.1-VDD C14.2 | 45.59,75.04 C15.2 | v30.48,44.07 29.59,43.05 28.83,41.4 29.59,40.26 28.72,38.26 LED7.1-VDD 24.64,28.19 21.84,27.56 20.83,25.4 21.21,24.38 21.59,22.48 LED6.1-VDD | LED6.1-VDD C12.2 | C11.2 LED5.1-VDD 13.46,7.24 12.7,9.65 15.49,13.84 19.94,18.8 LED6.1-VDD
  Bottom 0.406: C21.2 LED15.1-VDD | C20.2 LED14.1-VDD
  other vias: 93.45,5.07
N$20
  Bottom 0.254: LED10.4-DIN 56.64,90.81 55.75,89.92 50.42,78.74 48.01,77.6 LED9.2-DOUT
N$21
  Bottom 0.254: LED10.2-DOUT 56.9,94.11 58.17,92.46 62.23,92.46 70.1,76.83 LED11.4-DIN
N$22
  Bottom 0.254: LED11.2-DOUT 63.88,74.42 65.53,74.04 74.8,56.39 LED12.4-DIN
N$23
  Bottom 0.254: LED13.4-DIN 82.17,39.24 73.91,55.63 LED12.2-DOUT
N$24
  Bottom 0.254: LED14.4-DIN 92.33,20.83 89.33,24.59 84.71,32 82.17,37.08 80.65,39.62 LED13.2-DOUT
N$25
  Bottom 0.254: LED14.2-DOUT 89.58,23.32 92.58,19.81 94.62,20.57 98.93,13.21 101.22,8.56 LED15.4-DIN
N$26  (via drill 0.35)
  Top 0.254: v66.84,28.11 68.24,28.11 v68.47,28.34
  Bottom 0.254: LED16.4-DIN 66.8,28.07 v66.84,28.11 | v68.47,28.34 78.46,28.34 78.61,28.19 87.5,8.89 87.81,8.59 LED15.2-DOUT
N$27  (via drill 0.35)
  Top 0.254: v32.77,23.5 R8.2
  Bottom 0.254: LED5.4-DIN 19.43,2.79 22.1,2.79 v32.77,23.5
N$29
  Bottom 0.254: J1.2 97.92,1.52 90.42,1.52 78.36,27.69 68.2,27.69 66.67,29.21 57.24,29.21 LED16.2-DOUT
N$30  (via drill 0.35)
  Top 0.203: SW1.P$1 56.52,96.65 56.9,96.27 56.9,95.6 58.02,94.48 v58.02,94.09
  Bottom 0.203: SJ1.1 SW1.P$1 55.13,99.15 R1.1 | v58.02,94.09 58.55,95.12 60.45,95.12 61.72,93.6 SJ2.2
RESET  (via drill 0.3, 0.35)
  Top 0.203: J3.5 58.42,106.93 57.15,105.66 55.12,105.66 54.03,104.57 53.98,102.49 52.58,99.82 52.2,98.81 52.2,96.9 52.96,96.27 | 56.64,94.79 55.88,96.27 52.96,96.27 | 52.96,96.27 v51.69,94.74
  Top 0.254: C8.2 28.19,27.43 33.91,28.83 34.54,30.61 35.94,31.37 36.32,32.79 v37.28,34.52 | 37.08,36.45 U1.29 | 37.08,36.45 42.8,50.42 48.01,55.75 v54.74,73.15 | v56.9,88.52 56.64,94.79 | v37.72,36.2 37.08,36.45
  Bottom 0.203: v51.69,94.74 SJ1.2
  Bottom 0.254: v54.74,73.15 55.37,74.93 53.72,83.31 54.63,84.23 54.63,86.06 56.52,88.57 v56.9,88.52 | v37.28,34.52 37.28,34.87 v37.72,36.2
VIN  (via drill 0.35)
  Top 0.61: J1.3 100.2,4.57 97.66,4.57 96.14,7.11 94.11,7.37 IC2.1 80.9,32 77.12,33.66 70.74,44.45 58.55,71.37 56.52,73.66 46.61,77.22 45.09,76.45 IC1.1 42.8,77.47 42.29,78.23 v42.68,79.25
  Bottom 0.61: v42.68,79.25 51.94,100.58 53.34,101.85 J3.2
VUSB
  Top 0.254: C9.1 12.57,3.68 12.57,2.03 13.46,1.14 16.26,1.14 18.11,3 18.11,6.76 17.07,7.8 CN1.VBUS 17.07,11.51 14.48,14.1 D1.A
  Top 0.61: C10.2 C9.1

### Text on the board
tNames: Designed by: Tariq Muhanna